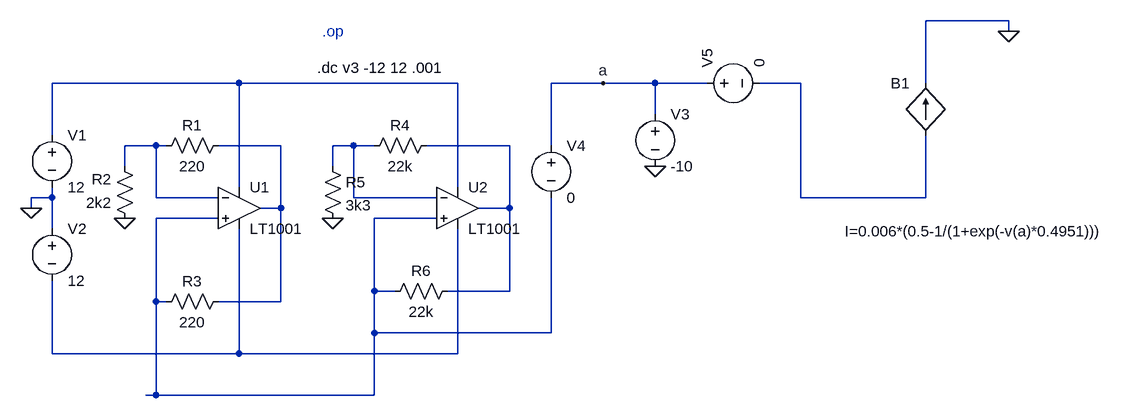
[diagram p0: schematic chua4.asc]
chua4.asc, the LTspice schematic file:
Version 4
SHEET 1 2520 724
WIRE 1392 -96 1264 -96
WIRE 1392 -80 1392 -96
WIRE 208 0 -80 0
WIRE 544 0 208 0
WIRE 768 0 688 0
WIRE 848 0 768 0
WIRE 928 0 848 0
WIRE 1072 0 1008 0
WIRE 1264 0 1264 -96
WIRE 848 48 848 0
WIRE -80 80 -80 0
WIRE 80 96 32 96
WIRE 96 96 80 96
WIRE 272 96 176 96
WIRE 384 96 352 96
WIRE 416 96 384 96
WIRE 624 96 496 96
WIRE 688 96 688 0
WIRE 32 128 32 96
WIRE 352 128 352 96
WIRE 208 160 208 0
WIRE 544 160 544 0
WIRE -80 176 -80 160
WIRE -80 176 -112 176
WIRE 80 176 80 96
WIRE 176 176 80 176
WIRE 384 176 384 96
WIRE 512 176 384 176
WIRE 1072 176 1072 0
WIRE 1264 176 1264 80
WIRE 1264 176 1072 176
WIRE -112 192 -112 176
WIRE 272 192 272 96
WIRE 272 192 240 192
WIRE 624 192 624 96
WIRE 624 192 576 192
WIRE 176 208 80 208
WIRE 512 208 416 208
WIRE -80 224 -80 176
WIRE 416 320 416 208
WIRE 448 320 416 320
WIRE 624 320 624 192
WIRE 624 320 528 320
WIRE 80 336 80 208
WIRE 96 336 80 336
WIRE 272 336 272 192
WIRE 272 336 176 336
WIRE 416 384 416 320
WIRE 688 384 688 176
WIRE 688 384 416 384
WIRE -80 416 -80 304
WIRE 208 416 208 224
WIRE 208 416 -80 416
WIRE 544 416 544 224
WIRE 544 416 208 416
WIRE 80 480 80 336
WIRE 80 480 64 480
WIRE 416 480 416 384
WIRE 416 480 80 480
FLAG -112 192 0
FLAG 32 208 0
FLAG 352 208 0
FLAG 848 128 0
FLAG 768 0 a
FLAG 1392 -80 0
DATAFLAG 624 192 ""
SYMBOL Opamps\\LT1001 208 128 R0
SYMATTR InstName U1
SYMBOL voltage -80 64 R0
WINDOW 123 0 0 Left 2
WINDOW 39 0 0 Left 2
SYMATTR InstName V1
SYMATTR Value 12
SYMBOL voltage -80 208 R0
WINDOW 123 0 0 Left 2
WINDOW 39 0 0 Left 2
SYMATTR InstName V2
SYMATTR Value 12
SYMBOL Opamps\\LT1001 544 128 R0
SYMATTR InstName U2
SYMBOL res 192 80 R90
WINDOW 0 0 56 VBottom 2
WINDOW 3 32 56 VTop 2
SYMATTR InstName R1
SYMATTR Value 220
SYMBOL res 48 224 R180
WINDOW 0 36 76 Left 2
WINDOW 3 36 40 Left 2
SYMATTR InstName R2
SYMATTR Value 2k2
SYMBOL res 80 352 R270
WINDOW 0 32 56 VTop 2
WINDOW 3 0 56 VBottom 2
SYMATTR InstName R3
SYMATTR Value 220
SYMBOL res 400 112 R270
WINDOW 0 32 56 VTop 2
WINDOW 3 0 56 VBottom 2
SYMATTR InstName R4
SYMATTR Value 22k
SYMBOL res 336 112 R0
SYMATTR InstName R5
SYMATTR Value 3k3
SYMBOL res 544 304 R90
WINDOW 0 0 56 VBottom 2
WINDOW 3 32 56 VTop 2
SYMATTR InstName R6
SYMATTR Value 22k
SYMBOL voltage 848 32 R0
WINDOW 123 0 0 Left 0
WINDOW 39 0 0 Left 0
SYMATTR InstName V3
SYMATTR Value -10
SYMBOL voltage 688 80 R0
WINDOW 123 0 0 Left 0
WINDOW 39 0 0 Left 0
SYMATTR InstName V4
SYMATTR Value 0
SYMBOL voltage 912 0 R270
WINDOW 123 0 0 Left 0
WINDOW 39 0 0 Left 0
SYMATTR InstName V5
SYMATTR Value 0
SYMBOL bi 1264 80 R180
WINDOW 3 -278 -148 Left 2
WINDOW 0 24 80 Left 2
SYMATTR Value I=0.006*(0.5-1/(1+exp(-v(a)*0.4951)))
SYMATTR InstName B1
TEXT 328 -24 Left 2 !.dc v3 -12 12 .001
TEXT 336 -80 Left 2 ;.op

The netlist it stands for:
* chua4.asc
XU1 N007 N003 N001 N008 N004 LT1001  ; pins In+ In- V+ V- OUT
V1 N001 0 12
V2 0 N008 12
XU2 N007 N005 N001 N008 N006 LT1001  ; pins In+ In- V+ V- OUT
R1 N004 N003 220
R2 0 N003 2k2
R3 N007 N004 220
R4 N005 N006 22k
R5 N005 0 3k3
R6 N006 N007 22k
V3 a 0 -10
V4 a N007 0
V5 a N002 0
B1 N002 0 I=0.006*(0.5-1/(1+exp(-v(a)*0.4951)))
.dc v3 -12 12 .001
* .op
.lib LTC.lib
.backanno
.end